# EAGLE design BLE-Shield-1_0_0-B (EAGLE 6.4)
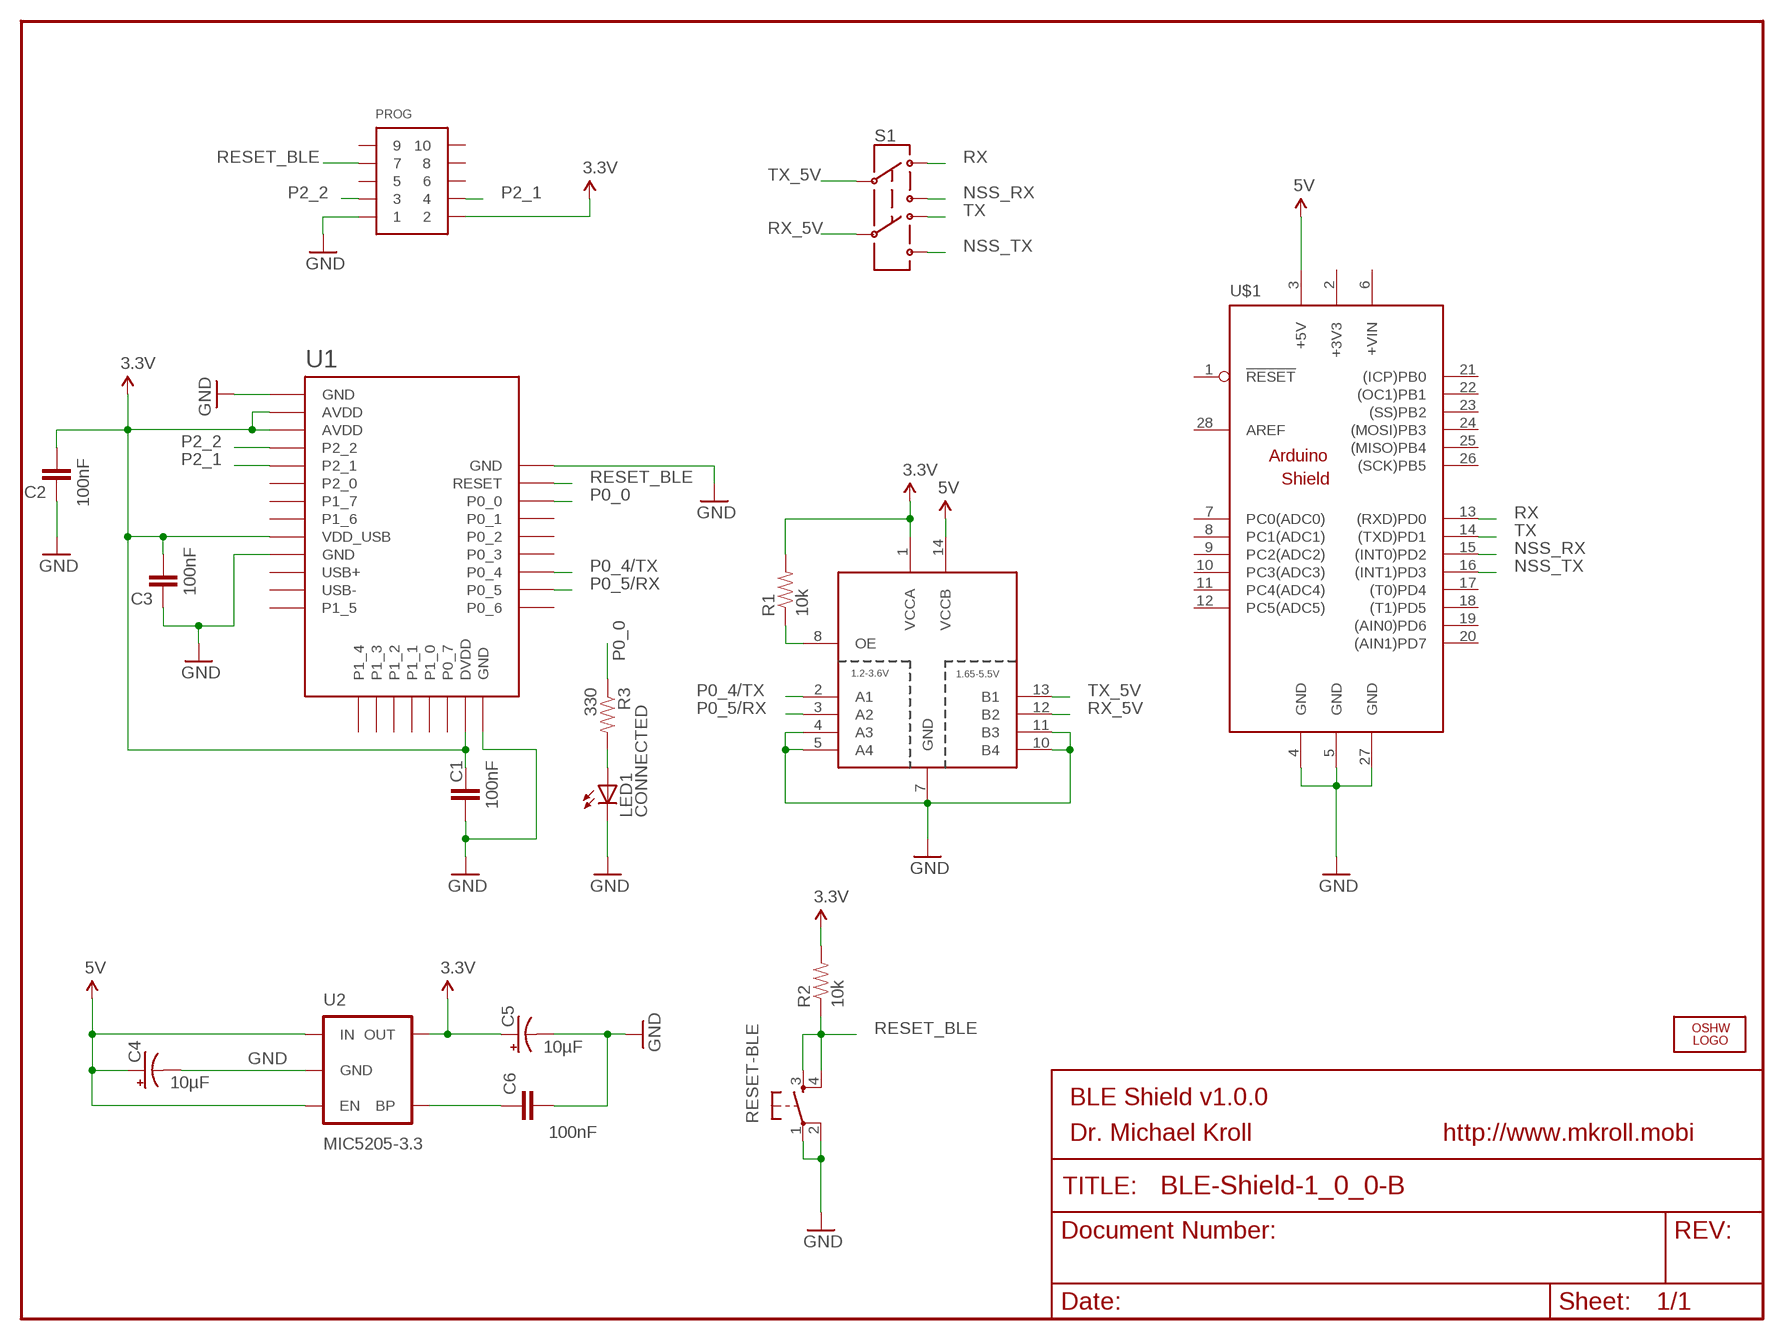
[diagram p0: schematic, sheet 1]

## Parts
C1  100nF  CAP1206  [1206]
C2  100nF  CAP1206  [1206]
C3  100nF  CAP1206  [1206]
C4  10µF  CAP_POL1206  [EIA3216]
C5  10µF  CAP_POL1206  [EIA3216]
C6  100nF  CAP1206  [1206]
LED1  CONNECTED  LED1206-BLUE  [LED-1206-BLUE]
LOGO1  LOGO-OSHW-FILLX0200-NT  [OSHW_FILLX200_NOTEXT]
PROG  CONN_5-2-FTSH-V  [FTSH-105-DV]
R1  10k  RESISTOR0805-RES  [0805]
R2  10k  RESISTOR0805-RES  [0805]
R3  330  RESISTOR0805-RES  [0805]
RESET-BLE  TAC_SWITCHSMD  [TACTILE_SWITCH_SMD]
S1  SWITCH-DPDTSMD  [AYZ0202]
U1  BLE112-A-VISUAL  [BLE112-A]
U2  MIC5205-3.3  V_REG_LDOSMD  [SOT23-5]
U3  TXB0104DR  [SO14]
U$1  ARDUINO_SHIELD  [ARDUINO_SHIELD]

## Nets
3.3V: C1.2 C2.2 C3.2 C5.A(+) PROG.2 R1.2 R2.2 U1.AVDD1(AVDD) U1.AVDD2(AVDD) U1.DVDD U1.VDD_USB U2.5(OUT) U3.1(VCCA)
5V: C4.A(+) U2.1(IN) U2.3(EN) U3.14(VCCB) U$1.3(+5V)
GND: C1.1 C2.1 C3.1 C4.C(-) C5.C(-) C6.2 LED1.C PROG.1 RESET-BLE.1 RESET-BLE.2 U1.GND1(GND) U1.GND2(GND) U1.GND3(GND) U1.GND4(GND) U2.2(GND) U3.4(A3) U3.5(A4) U3.7(GND) U3.10(B4) U3.11(B3) U$1.4(GND) U$1.5(GND) U$1.27(GND)
N$2: C6.1 U2.4(BP)
N$4: LED1.A R3.2
N$6: R1.1 U3.8(OE)
NSS_RX: S1.3 U$1.15((INT0)PD2)
NSS_TX: S1.6 U$1.16((INT1)PD3)
P0_0: R3.1 U1.P0_0
P0_4/TX: U1.P0_4 U3.2(A1)
P0_5/RX: U1.P0_5 U3.3(A2)
P2_1: PROG.4 U1.P2_1
P2_2: PROG.3 U1.P2_2
RESET_BLE: PROG.7 R2.1 RESET-BLE.3 RESET-BLE.4 U1.RESET
RX: S1.1 U$1.13((RXD)PD0)
RX_5V: S1.5 U3.12(B2)
TX: S1.4 U$1.14((TXD)PD1)
TX_5V: S1.2 U3.13(B1)
Unconnected: PROG.5 PROG.6 PROG.8 PROG.9 PROG.10 U1.P0_1 U1.P0_2 U1.P0_3 U1.P0_6 U1.P0_7 U1.P1_0 U1.P1_1 U1.P1_2 U1.P1_3 U1.P1_4 U1.P1_5 U1.P1_6 U1.P1_7 U1.P2_0 U1.USB+ U1.USB- U$1.1(!RESET) U$1.6(+VIN) U$1.7(PC0(ADC0)) U$1.8(PC1(ADC1)) U$1.9(PC2(ADC2)) U$1.10(PC3(ADC3)) U$1.11(PC4(ADC4)) U$1.12(PC5(ADC5)) U$1.17((T0)PD4) U$1.18((T1)PD5) U$1.19((AIN0)PD6) U$1.20((AIN1)PD7) U$1.21((ICP)PB0) U$1.22((OC1)PB1) U$1.23((SS)PB2) U$1.24((MOSI)PB3) U$1.25((MISO)PB4) U$1.26((SCK)PB5) U$1.28(AREF)

## Notes on the sheet
- BLE Shield v1.0.0
- Dr. Michael Kroll | http://www.mkroll.mobi

## Power pins joined to a net without a drawn wire
+3V3: U$1.2(+3V3)

## Library data of the parts
C1-C3 C6 = SparkFun:CAP: Capacitor Standard 0603 ceramic capacitor, and 0.1" leaded capacitor.
C4 C5 = SparkFun:CAP_POL: Capacitor Polarized These are standard SMD and PTH capacitors. Normally 10uF, 47uF, and 100uF in electrolytic and tantalum varieties. Always verify the external diameter of the through hole cap, it varies with capacity, voltage, and manufacturer. The EIA devices should be standard.
LED1 = SparkFun:LED: LEDs Standard schematic elements and footprints for 5mm, 3mm, 1206, and 0603 sized LEDs. 5mm - Spark Fun Electronics SKU : COM-00529 (and others)
LOGO1 = Logo:LOGO-OSHW-FILL
PROG = pel_misc:CONN_5-2
R1-R3 = SparkFun:RESISTOR: Resistor Basic schematic elements and footprints for 0603, 1206, and PTH resistors.
RESET-BLE = SparkFun:TAC_SWITCH: Momentary Switch Button commonly used for reset or general input. Spark Fun Electronics SKU : COM-00097
S1 = SparkFun:SWITCH-DPDT: DPDT Version of the COM-00597
U1 = sf-bluegiga:BLE112-A-VISUAL: Bluetooth Low Energy single-mode module - Bluetooth 4.0, chip antenna
U2 = SparkFun:V_REG_LDO: Voltage Regulator LDO Standard 150mA LDO voltage regulator in SOT-23 layout. Micrel part MIC5205. BP (by-pass) pin is used to lower output noise with 470pF cap.
U3 = Software-Culture-Parts:TXB0104DR: 4-Bit Bi-Directional Level Shifter 1.2V-3.6V (VCCA) to 1.65V-5.5V (VCCB) bi-directional level shifter with auto direction sensing. Max data rate - VCCA 1.8V: 20Mbps (50ns), VCCA 3.3V: 100Mbps (10ns) Digikey: 296-21929-1-ND
U$1 = arduino:ARDUINO_SHIELD: Arduino Shield

## Board
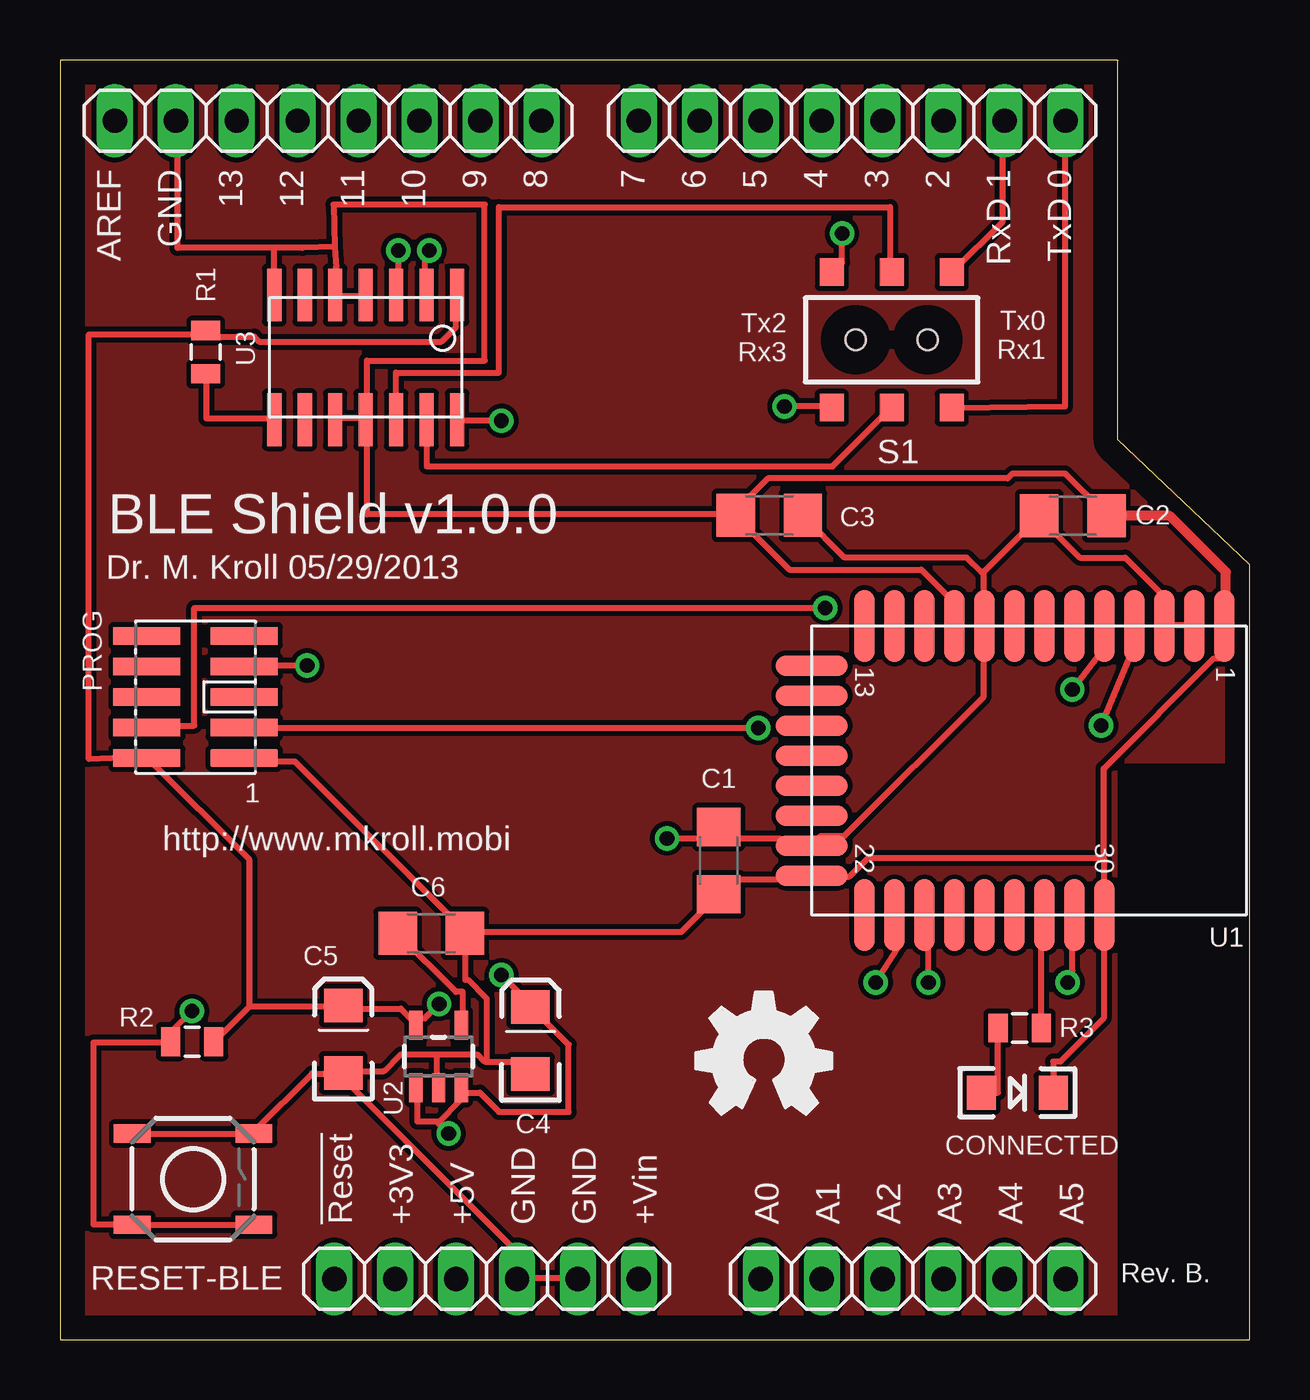
[diagram p1: board, top side]
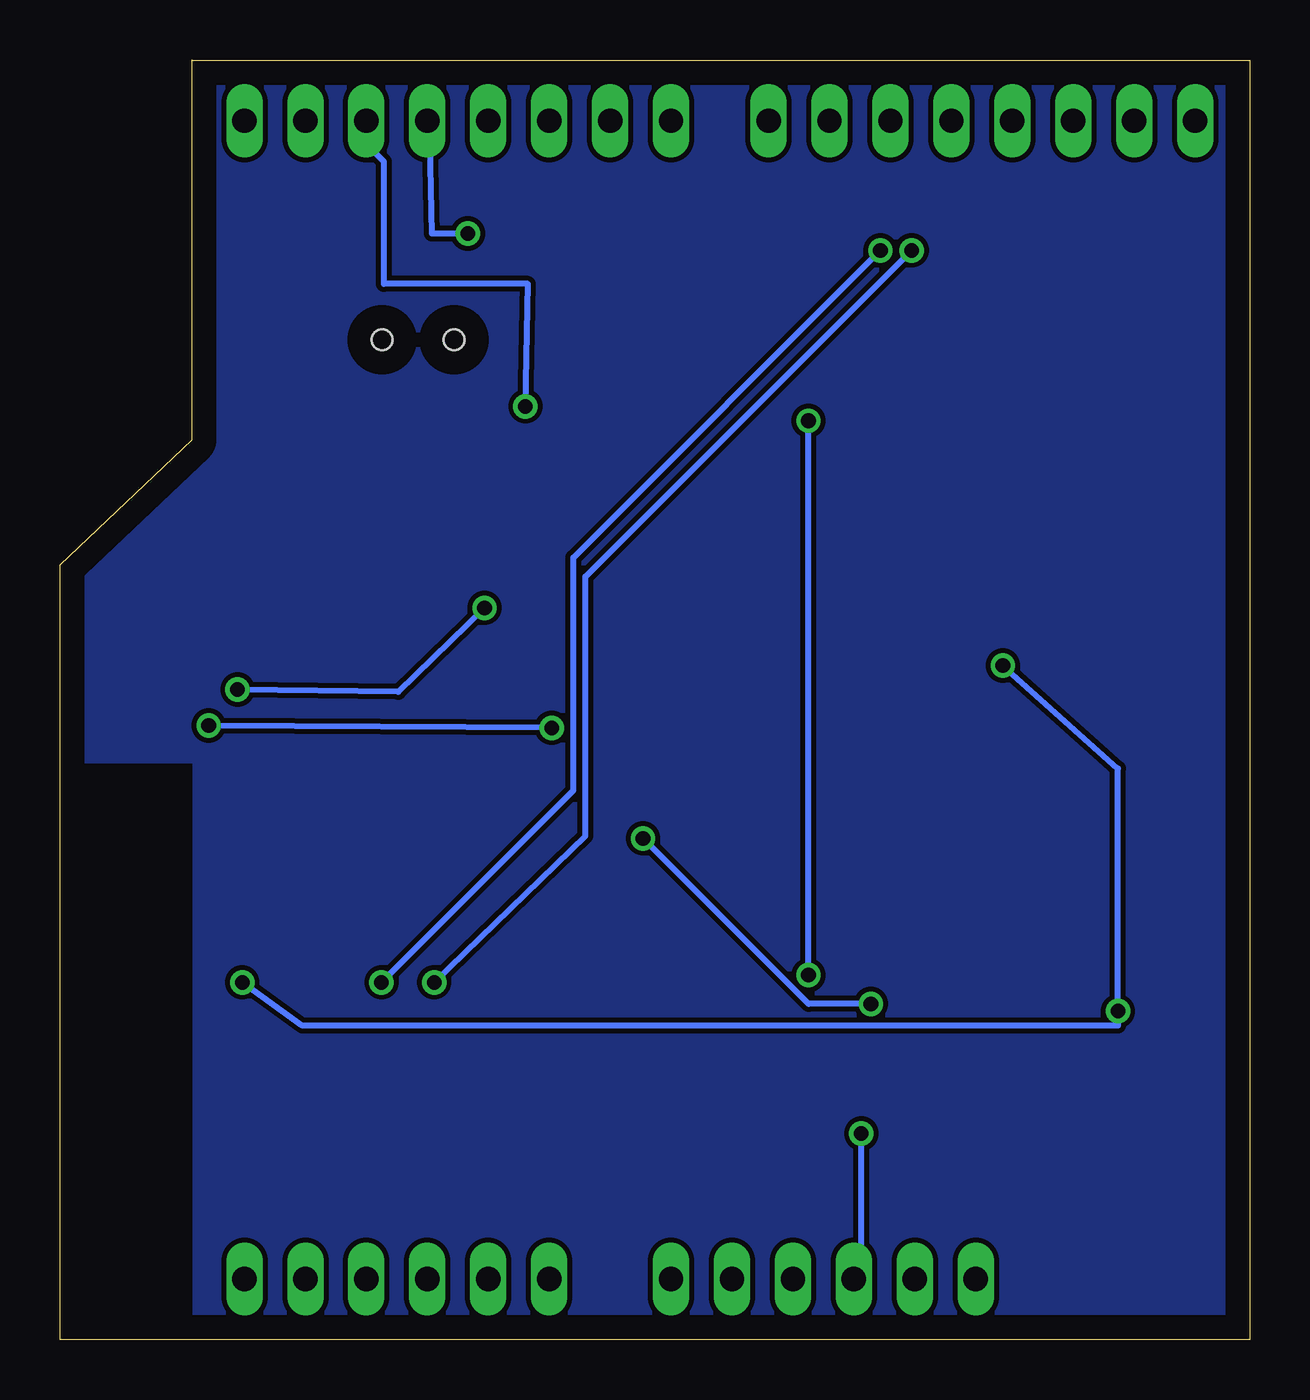
[diagram p2: board, bottom side, seen from below]

Size 49.6 x 53.33 mm. Coordinates in mm from the lower left corner, seen from the top.
Outline: 44.1,53.33 44.1,37.5 49.6,32.3 49.6,0 0,0 0,53.33 44.1,53.33
Outline: 44.1,53.33 44.12,53.33
Copper layers (1*16): Top 0.035mm / dielectric 1.5mm / Bottom 0.035mm
Design rules "default": minimum track width 10mil, minimum drill 24mil, track to track 8mil, track to pad 8mil, pad to pad 8mil, via to via 8mil, smd to smd 8mil, copper to edge 40mil, drill to drill 8mil, minimum pad ring 10mil, minimum via ring 8mil, stop-mask expansion 4mil, vias tented up to drill 0mil, thermal gap 10mil
tRestrict: area 44.1,0.1 to 49.6,24
bRestrict: area 44.1,-0.1 to 49.5,24

### Footprints (pad centres in the part's own frame; a part is rotated, then mirrored left to right if it is on the bottom)
1206 = smd 1.6 x 1.8: 1 -1.4,0; 2 1.4,0
EIA3216 = smd 1.4 x 1.6: A 1.4,0; C -1.4,0
LED-1206-BLUE = smd 1.2 x 1.4: A -1.5,0; C 1.5,0
FTSH-105-DV = smd 0.74 x 2.8: 1 -2.54,-2.03; 2 -2.54,2.03; 3 -1.27,-2.03; 4 -1.27,2.03; 5 0,-2.03; 6 0,2.03; 7 1.27,-2.03; 8 1.27,2.03; 9 2.54,-2.03; 10 2.54,2.03
0805 = smd 0.8 x 1.2: 1 -0.9,0; 2 0.9,0
TACTILE_SWITCH_SMD = smd 1.524 x 0.762: 1 -2.54,1.905; 2 2.54,1.905; 3 -2.54,-1.905; 4 2.54,-1.905
AYZ0202 = smd 1 x 1.15: 1 -2.5,2.825; 2 0,2.825; 3 2.5,2.825; 4 -2.5,-2.825; 5 0,-2.825; 6 2.5,-2.825 | hole 0.85: 1.5,0; -1.5,0
BLE112-A = smd 3 x 0.85: AVDD1 -6.05,6.9; AVDD2 -6.05,5.65; GND1 -6.05,8.15; GND2 -6.05,-3.1; GND4 6,3.15; P0_0 6,0.65; P0_1 6,-0.6; P0_2 6,-1.85; P0_3 6,-3.1; P0_4 6,-4.35; P0_5 6,-5.6; P0_6 6,-6.85; P1_5 -6.05,-6.85; P1_6 -6.05,-0.6; P1_7 -6.05,0.65; P2_0 -6.05,1.9; P2_1 -6.05,3.15; P2_2 -6.05,4.4; RESET 6,1.9; USB+ -6.05,-4.35; USB- -6.05,-5.6; VDD_USB -6.05,-1.85 | smd 0.85 x 3: DVDD 3.1,-9.05; GND3 4.35,-9.05; P0_7 1.85,-9.05; P1_0 0.6,-9.05; P1_1 -0.65,-9.05; P1_2 -1.9,-9.05; P1_3 -3.15,-9.05; P1_4 -4.4,-9.05
SOT23-5 = smd 0.55 x 1.2: 1 -0.95,-1.3; 2 0,-1.3; 3 0.95,-1.3; 4 0.95,1.3; 5 -0.95,1.3
SO14 = smd 0.6 x 2.2: 1 -3.81,-2.6; 2 -2.54,-2.6; 3 -1.27,-2.6; 4 0,-2.6; 5 1.27,-2.6; 6 2.54,-2.6; 7 3.81,-2.6; 8 3.81,2.6; 9 2.54,2.6; 10 1.27,2.6; 11 0,2.6; 12 -1.27,2.6; 13 -2.54,2.6; 14 -3.81,2.6
ARDUINO_SHIELD = drill 1.016 long: 1 19.05,-8.89; 2 21.59,-8.89; 3 24.13,-8.89; 4 26.67,-8.89; 5 29.21,-8.89; 6 31.75,-8.89; 7 36.83,-8.89; 8 39.37,-8.89; 9 41.91,-8.89; 10 44.45,-8.89; 11 46.99,-8.89; 12 49.53,-8.89; 13 49.53,39.37; 14 46.99,39.37; 15 44.45,39.37; 16 41.91,39.37; 17 39.37,39.37; 18 36.83,39.37; 19 34.29,39.37; 20 31.75,39.37; 21 27.686,39.37; 22 25.146,39.37; 23 22.606,39.37; 24 20.066,39.37; 25 17.526,39.37; 26 14.986,39.37; 27 12.446,39.37; 28 9.906,39.37

### Placement (x,y rotation side)
C1  27.46,19.97 90 top
C2  42.22,34.34 180 top
C3  29.57,34.36 0 top
C4  19.61,12.48 90 top
C5  11.81,12.53 90 top
C6  15.48,16.94 0 top
LED1  39.9,10.3 0 top
LOGO1  26.5,9.4 0 top
PROG  5.65,26.79 90 top
R1  6.07,41.16 90 top
R2  5.51,12.43 0 top
R3  40,13 180 top
RESET-BLE  5.55,6.7 0 top
S1  34.67,41.67 180 top
U1  40.39,23.7 270 top
U2  15.78,11.81 0 top
U3  12.74,40.94 180 top
U$1  -7.62,11.43 0 top

### Tracks (layer width: path | path; a pad name or v marks a point on that pad's centre or on a via)
3.3V  (via drill 0.61)
  Top 0.254: U1.AVDD1 47.2,29.8 46.1,29.8 U1.AVDD2 46.1,29.9 46.1,31.1 45.9,31.1 44.4,32.6 42.5,32.6 40.9,34.2 40.8,34.2 C2.2 40.8,34.3 38.5,32 | 38.5,32 38.5,29.8 U1.VDD_USB 38.5,29.7 38.5,26.8 32.7,21 31.7,21 31.4,20.7 U1.DVDD 30.3,20.6 30,20.9 27.9,20.9 27.5,21.3 C1.2 27.4,21.3 27,20.9 v25.3,20.9 | C3.2 31,34.3 32.7,32.6 37.8,32.6 38.4,32 38.5,32 | U3.1 16.5,43.5 16.5,42.2 15.9,41.6 8.3,41.6 8.1,41.8 6.3,41.8 6.1,42 R1.2 6.1,41.9 1.2,41.9 1.2,24.2 3.6,24.3 PROG.2 3.7,24.2 7.9,20 7.9,13.9 | 7.9,13.9 6.5,12.5 R2.2 | 7.9,13.9 11.8,13.9 C5.A 11.8,13.8 14.2,13.8 14.8,13.2 U2.5 14.7,13.4 15.2,13.4 v15.8,14
  Bottom 0.254: v25.3,20.9 18.4,14 v15.8,14
5V  (via drill 0.61)
  Top 0.254: 15.8,9.1 14.9,9.1 14.9,10.5 U2.1 | 15.8,9.1 16.7,10 16.7,10.5 U2.3 16.8,10.3 17.5,10.3 18.3,9.5 21.2,9.5 21.2,12.3 19.7,13.8 C4.A 19.6,14 v18.4,15.2 | v18.4,38.3 16.6,38.3 U3.14 | v16.2,8.6 15.8,9 15.8,9.1
  Bottom 0.254: v18.4,15.2 v18.4,38.3 | v16.2,8.6 16.2,2.9 16.5,2.6 U$1.3
GND
  Top 0.254: 8.9,45.5 8.9,43.6 U3.7 | 11.45,45.55 10.1,45.5 8.9,45.5 | 11.45,45.55 11.5,44.7 11.5,43.6 U3.5 11.5,43.5 12.7,43.5 U3.4 | U$1.27 4.9,50.8 4.9,45.5 8.9,45.5 | U3.10 11.5,38.4 12.7,38.4 U3.11 | C3.1 28.2,34.3 30.4,32.1 35.9,32.1 37.2,30.8 37.2,29.8 U1.GND2 | U3.11 12.8,38.3 12.8,34.4 28.1,34.4 C3.1 | 11.45,45.55 11.4,47.3 17.7,47.3 17.7,40.8 12.8,40.8 12.8,38.5 12.7,38.5 U3.11 | LED1.C 41.4,11.6 41.7,11.6 43.5,13.4 43.5,17.7 U1.GND4 43.5,17.8 43.5,20.1 | U$1.5 21.5,2.6 19.1,2.6 U$1.4 19.1,2.7 19.1,3.9 18.8,3.9 11.7,11 C5.C | RESET-BLE.1 3.1,8.6 8,8.6 RESET-BLE.2 8.1,8.7 10.5,11.1 11.7,11.1 C5.C | 15.7,11.9 15.7,10.6 U2.2 | 15.7,11.9 14.2,11.9 13.5,11.2 11.9,11.2 C5.C | 17.8,11.6 17.7,11.6 17.4,11.9 15.7,11.9 | 17.8,11.6 19.1,11.6 19.6,11.1 C4.C | C6.2 16.9,16.9 16.9,15 17,15 17.8,14.2 17.8,11.6 | PROG.1 7.7,24.2 7.8,24.1 9.8,24.1 16.9,17 C6.2 | C6.2 17,17 25.9,17 27.4,18.5 C1.1 27.5,18.6 28.1,19.2 29.9,19.2 30,19.3 31.3,19.3 U1.GND3 31.4,19.3 32.9,19.3 33.7,20.1 43.5,20.1 | U1.GND1 48.4,29.7 48.4,28.4 48.1,28.4 43.5,23.8 43.5,20.1 | C3.1 28.1,34.5 29.5,35.9 39.5,35.9 39.7,36.1 41.9,36.1 43.5,34.5 C2.1
  Top 0.406: C2.1 46.26,34.34 48.6,32 48.6,29.81 U1.GND1
N$1
  pour Bottom: 0,53.3 44.1,53.3 44.1,37.7 49.7,32.1 49.7,0.2 49.6,0.1 44.1,0 0,0
N$2
  Top 0.254: U2.4 16.8,13.2 16.8,14.5 16.5,14.5 14.1,16.9 C6.1
N$3
  pour Top: 0,53.3 44.1,53.3 44.1,37.8 49.6,32.3 49.6,0 44.1,0 0,0
N$4
  Top 0.254: R3.2 39.1,10.3 LED1.A
N$6
  Top 0.254: R1.1 6.1,40.2 6.1,38.4 8.9,38.4 U3.8
NSS_RX  (via drill 0.61)
  Top 0.254: v30.2,38.9 32.1,38.9 S1.3
  Bottom 0.254: v30.2,38.9 30.1,44 36.1,44 36.1,49.1 36.8,49.8 36.8,50.8 U$1.15
NSS_TX  (via drill 0.61)
  Top 0.254: v32.6,46.1 32.6,44.9 32.2,44.5 S1.6
  Bottom 0.254: v32.6,46.1 34.1,46.1 34.2,50.8 U$1.16
P0_0
  Top 0.254: R3.1 40.9,17.7 U1.P0_0
P0_4/TX  (via drill 0.61)
  Top 0.254: v15.4,45.4 15.2,45.4 15.2,43.6 U3.2 | v36.2,14.9 36.2,17.7 U1.P0_4
  Bottom 0.254: v15.4,45.4 28.2,32.6 28.2,22.9 v36.2,14.9
P0_5/RX  (via drill 0.61)
  Top 0.254: v14.1,45.4 14.1,43.6 U3.3 | v34,14.9 34.9,16.3 34.9,17.7 U1.P0_5
  Bottom 0.254: v14.1,45.4 27.7,31.8 27.7,21 v34,14.9
P2_1  (via drill 0.61)
  Top 0.254: v31.9,30.5 5.6,30.5 5.6,25.6 4.6,25.6 PROG.4 | v42.2,27.1 43.5,28.8 43.5,29.7 U1.P2_1
  Bottom 0.254: v31.9,30.5 35.5,27 v42.2,27.1
P2_2  (via drill 0.61)
  Top 0.254: v29.1,25.5 7.7,25.5 PROG.3 | v43.4,25.6 44.7,28.7 44.7,29.7 U1.P2_2
  Bottom 0.254: v29.1,25.5 v43.4,25.6
RESET_BLE  (via drill 0.61)
  Top 0.254: RESET-BLE.4 8,4.8 3.2,4.8 RESET-BLE.3 3.1,4.8 1.4,4.8 1.4,12.4 4.6,12.4 R2.1 4.7,12.5 4.7,12.9 v5.5,13.7 | v10.3,28.1 7.7,28.1 PROG.7 | v42,14.9 42.2,15.4 42.2,17.7 U1.RESET
  Bottom 0.254: v10.3,28.1 5.5,23.8 v5.5,13.7 5.5,13.1 39.5,13.1 v42,14.9
RX
  Top 0.254: S1.1 41.9,38.9 U$1.13
RX_5V
  Top 0.254: S1.5 34.6,44.5 34.6,47.2 18.3,47.2 18.3,40.3 14,40.3 14,38.4 U3.12
TX
  Top 0.254: S1.4 37.2,44.5 39.3,46.6 39.3,50.8 U$1.14
TX_5V
  Top 0.254: S1.2 34.6,38.8 32.2,36.4 15.3,36.4 15.3,38.3 U3.13

### Text on the board
tNames: Tx2 / Rx3 | Tx0 / Rx1 | BLE Shield v1.0.0 | Dr. M. Kroll 05/29/2013 | 1 | http://www.mkroll.mobi | Rev. B.